# EAGLE design machine-terminals (EAGLE 5.04)
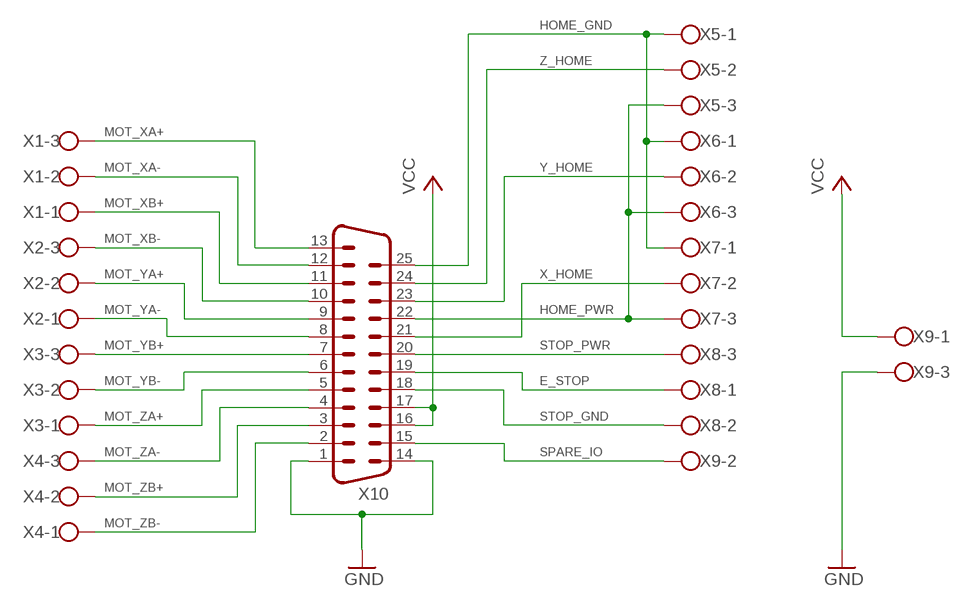
[diagram p0: schematic, sheet 1]

## Parts
X1  W237-03P  [W237-133]
X2  W237-03P  [W237-133]
X3  W237-03P  [W237-133]
X4  W237-03P  [W237-133]
X5  W237-03P  [W237-133]
X6  W237-03P  [W237-133]
X7  W237-03P  [W237-133]
X8  W237-03P  [W237-133]
X9  W237-03P  [W237-133]
X10  M25VP  [M25VP]

## Nets
E_STOP: X8.2 X10.18
GND: X9.3 X10.1 X10.14
HOME_GND: X5.1 X6.1 X7.1 X10.25
HOME_PWR: X5.3 X6.3 X7.3 X10.22
MOT_XA+: X1.3 X10.13
MOT_XA-: X1.2 X10.12
MOT_XB+: X1.1 X10.11
MOT_XB-: X2.3 X10.10
MOT_YA+: X2.2 X10.9
MOT_YA-: X2.1 X10.8
MOT_YB+: X3.3 X10.7
MOT_YB-: X3.2 X10.6
MOT_ZA+: X3.1 X10.5
MOT_ZA-: X4.3 X10.4
MOT_ZB+: X4.2 X10.3
MOT_ZB-: X4.1 X10.2
SPARE_IO: X9.2 X10.15
STOP_GND: X8.1 X10.19
STOP_PWR: X8.3 X10.20
VCC: X9.1 X10.16 X10.17
X_HOME: X7.2 X10.21
Y_HOME: X6.2 X10.23
Z_HOME: X5.2 X10.24

## Library data of the parts
X1-X9 = con-wago-508:W237-03P: WAGO SREW CLAMP
X10 = con-subd:M25: SUB-D

## Board
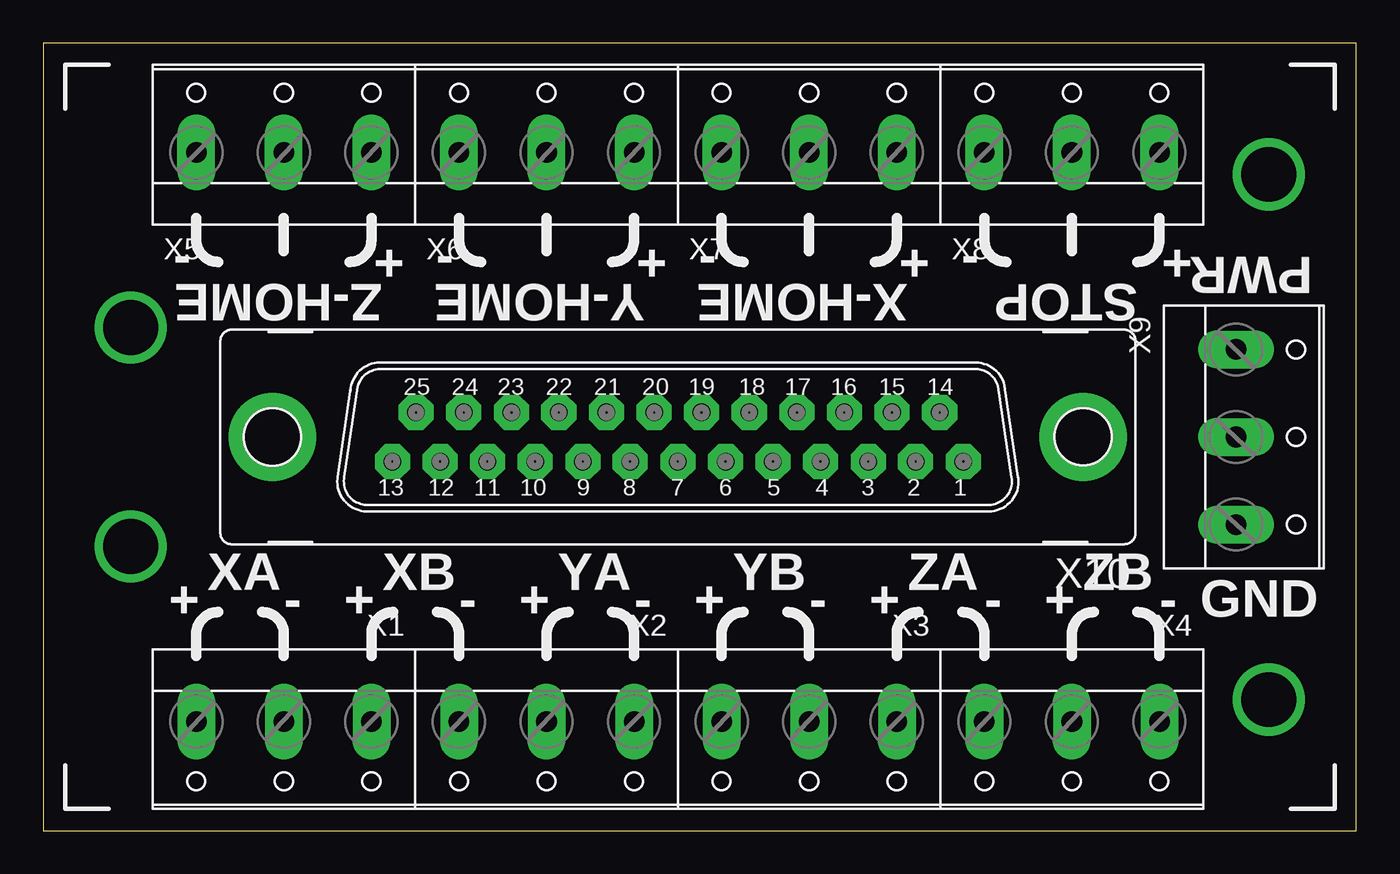
[diagram p1: board, top side]
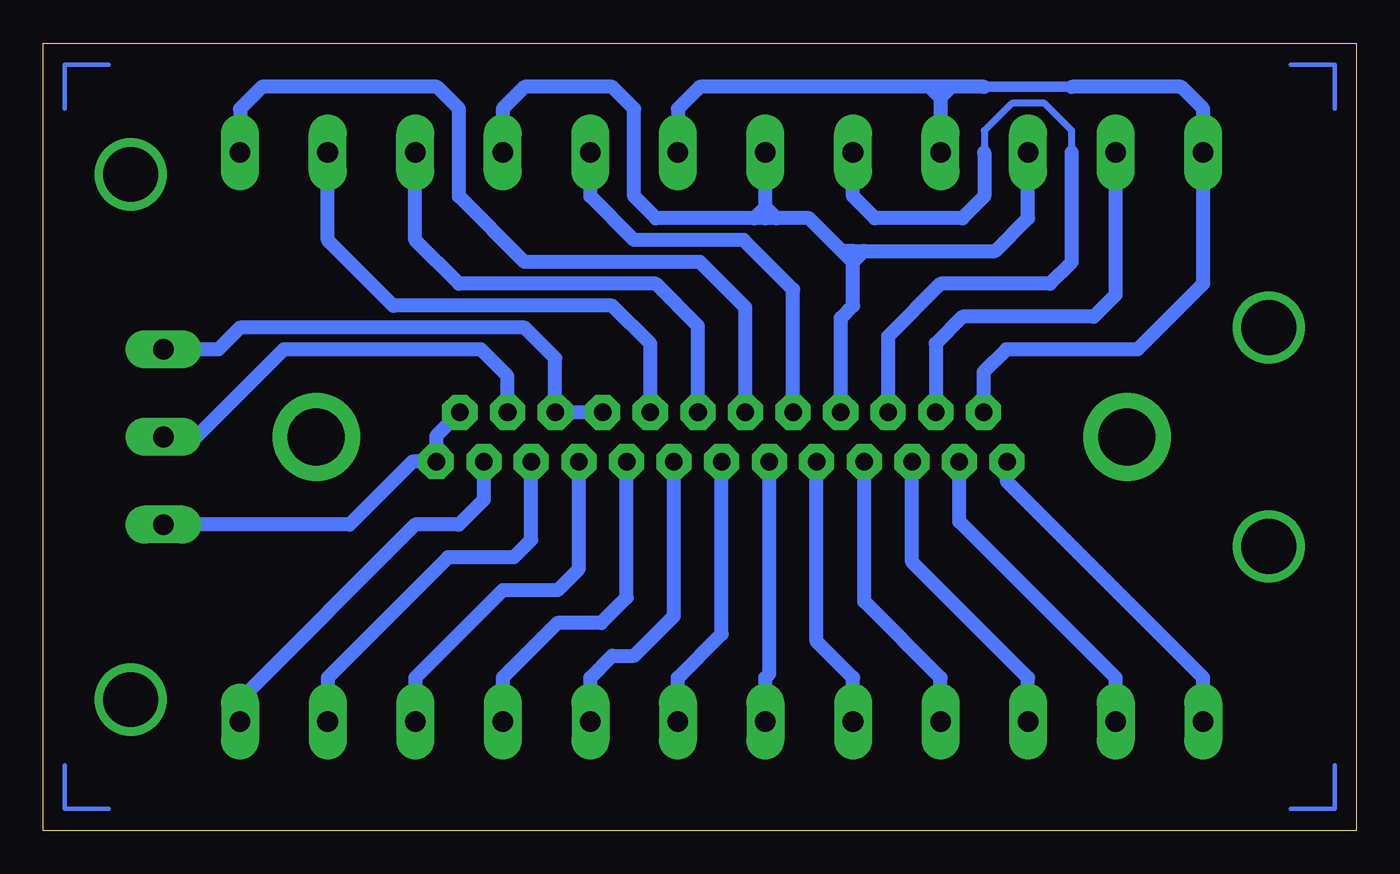
[diagram p2: board, bottom side, seen from below]

Size 76.2 x 45.72 mm. Coordinates in mm from the lower left corner, seen from the top.
Outline: 0,0 76.2,0 76.2,45.72 0,45.72 0,0
Copper layers (1*16): Top 0.035mm / dielectric 1.5mm / Bottom 0.035mm
Design rules "default *": minimum track width 12mil, minimum drill 24mil, track to track 16mil, track to pad 16mil, pad to pad 16mil, via to via 16mil, smd to smd 8mil, copper to edge 40mil, drill to drill 8mil, minimum pad ring 20mil, minimum via ring 12mil, stop-mask expansion 4mil, vias tented up to drill 0mil, thermal gap 10mil

### Footprints (pad centres in the part's own frame; a part is rotated, then mirrored left to right if it is on the bottom)
W237-133 = drill 1.194 long: 1 -5.08,-0.635; 2 0,-0.635; 3 5.08,-0.635
M25VP = drill 1.016 octagon: 1 -16.561,1.422; 2 -13.792,1.422; 3 -11.049,1.422; 4 -8.28,1.422; 5 -5.512,1.422; 6 -2.769,1.422; 7 0,1.422; 8 2.769,1.422; 9 5.512,1.422; 10 8.28,1.422; 11 11.049,1.422; 12 13.792,1.422; 13 16.561,1.422; 14 -15.189,-1.422; 15 -12.421,-1.422; 16 -9.652,-1.422; 17 -6.909,-1.422; 18 -4.14,-1.422; 19 -1.372,-1.422; 20 1.372,-1.422; 21 4.14,-1.422; 22 6.909,-1.422; 23 9.652,-1.422; 24 12.421,-1.422; 25 15.189,-1.422 | drill 3.302 pad 5.08 round: G1 -23.52,0; G2 23.52,0

### Placement (x,y rotation side)
X1  13.97,5.71 180 top
X2  29.21,5.71 180 top
X3  44.45,5.71 180 top
X4  59.69,5.71 180 top
X5  13.97,40.01 0 top
X6  29.21,40.01 0 top
X7  44.45,40.01 0 top
X8  59.69,40.01 0 top
X9  69.85,22.86 270 top
X10  36.83,22.86 180 top

### Tracks (layer width: path | path; a pad name or v marks a point on that pad's centre or on a via)
E_STOP
  Bottom 0.813: X10.18 40.97,28.27 43.18,30.48 55.88,30.48 59.69,34.29 X8.2
GND
  Bottom 0.813: X9.3 58.42,17.78 54.76,21.44 X10.1 53.39,22.91 X10.14
HOME_GND
  Bottom 0.61: 16.51,43.18 21.59,43.18
  Bottom 0.813: X7.1 39.37,41.91 38.1,43.18 24.77,43.18 | 21.59,43.18 23.49,43.18 | 23.49,43.18 24.13,43.18 | 24.13,43.18 24.77,43.18 | 16.51,43.18 10.16,43.18 8.89,41.91 X5.1 8.89,31.75 12.7,27.94 20.32,27.94 21.64,26.62 X10.25 | 24.13,42.55 X6.1 | 24.13,43.18 24.13,42.55 | 24.13,42.55 24.77,43.18 | 23.49,43.18 24.13,42.55
HOME_PWR
  Bottom 0.813: X7.3 49.53,41.91 48.26,43.18 43.18,43.18 41.91,41.91 41.91,36.83 40.64,35.56 34.92,35.56 | X5.3 19.05,35.56 20.95,33.66 28.58,33.66 | 34.29,35.56 34.92,35.56 | 34.29,35.56 34.29,36.2 | 34.29,36.2 X6.3 | 29.21,33.66 28.58,33.66 | 29.21,33.66 29.84,33.66 | 29.84,33.66 31.75,35.56 33.66,35.56 | 33.66,35.56 34.29,35.56 | X10.22 29.92,29.77 29.21,30.48 29.21,33.02 | 29.21,33.02 29.21,33.66 | 33.66,35.56 34.29,36.2 | 34.29,36.2 34.92,35.56 | 28.58,33.66 29.21,33.02 | 29.21,33.02 29.84,33.66
MOT_XA+
  Bottom 0.813: X10.13 20.27,20.27 8.89,8.89 X1.3
MOT_XA-
  Bottom 0.813: X1.2 13.97,8.89 23.04,17.96 X10.12
MOT_XB+
  Bottom 0.813: X10.11 25.78,15.62 19.05,8.89 X1.1
MOT_XB-
  Bottom 0.813: X10.10 28.55,13.31 24.13,8.89 X2.3
MOT_YA+
  Bottom 0.813: X10.9 31.32,11 29.21,8.89 X2.2
MOT_YA-
  Bottom 0.813: X10.8 34.06,9.12 34.29,8.89 X2.1
MOT_YB+
  Bottom 0.813: X3.3 39.37,8.89 36.83,11.43 X10.7
MOT_YB-
  Bottom 0.813: X10.6 39.6,12.47 41.91,10.16 43.18,10.16 44.45,8.89 X3.2
MOT_ZA+
  Bottom 0.813: X10.5 42.34,13.54 43.81,12.06 46.35,12.06 49.53,8.89 X3.1
MOT_ZA-
  Bottom 0.813: X10.4 45.11,15.22 46.35,13.97 49.53,13.97 54.61,8.89 X4.3
MOT_ZB+
  Bottom 0.813: X10.3 47.88,16.89 48.9,15.87 52.71,15.87 59.69,8.89 X4.2
MOT_ZB-
  Bottom 0.813: X10.2 50.62,19.23 52.07,17.78 54.61,17.78 64.77,7.62 X4.1
N$1
  Bottom 0.254: 72.39,44.45 74.93,44.45 74.93,41.91
N$2  (via drill 3.17)
  other vias: 71.12,38.1
N$3
  Bottom 0.254: 72.39,1.27 74.93,1.27 74.93,3.81
N$4
  Bottom 0.254: 1.27,3.81 1.27,1.27 3.81,1.27
N$5
  Bottom 0.254: 1.27,41.91 1.27,44.45 3.81,44.45
N$6  (via drill 3.17)
  other vias: 71.12,7.62
N$7  (via drill 3.17)
  other vias: 5.08,29.21
N$8  (via drill 3.17)
  other vias: 5.08,16.51
SPARE_IO
  Bottom 0.813: X10.15 49.25,26.39 50.8,27.94 62.23,27.94 67.31,22.86 X9.2
STOP_GND
  Bottom 0.813: X10.19 38.2,29.31 40.64,31.75 52.07,31.75 54.61,34.29 X8.1
STOP_PWR
  Bottom 0.813: X8.3 64.77,41.91 63.5,43.18 53.34,43.18 52.07,41.91 52.07,36.83 48.26,33.02 38.1,33.02 35.46,30.38 X10.20
VCC
  Bottom 0.813: X10.17 X10.16 46.48,27.43 48.26,29.21 64.77,29.21 66.04,27.94 X9.1
X_HOME
  Bottom 0.813: X7.2 44.45,36.83 41.91,34.29 35.56,34.29 32.69,31.42 X10.21
Y_HOME
  Bottom 0.406: 16.51,39.37 16.51,40.64 18.1,42.23 20,42.23 21.59,40.64 21.59,39.37
  Bottom 0.813: X6.2 29.21,36.83 27.94,35.56 22.86,35.56 21.59,36.83 21.59,39.37 | 16.51,39.37 16.51,33.02 17.78,31.75 24.13,31.75 27.18,28.7 X10.23
Z_HOME
  Bottom 0.813: X5.2 13.97,31.12 15.24,29.84 22.86,29.84 24.41,28.3 X10.24

### Text on the board
tSilk: - | + | - | + | - | + | - | + | PWR | Z-HOME | Y-HOME | X-HOME | STOP | GND | XA | XB | YA | YB | ZA | ZB | + | - | + | - | + | - | + | - | + | - | + | -